# Altium schematic sheet polulu_power.SchDoc
size A4
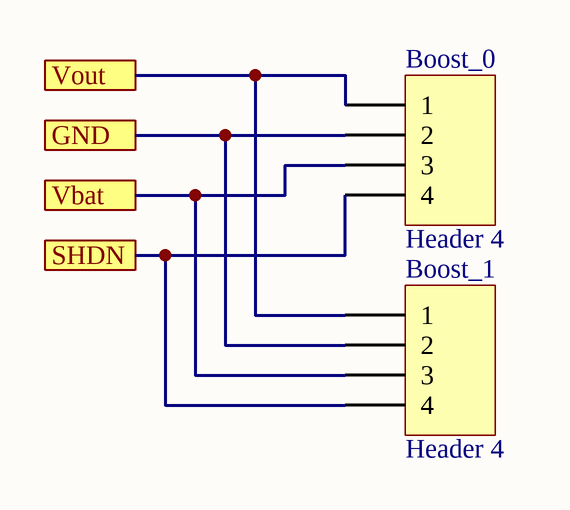
[diagram p0: polulu_power.SchDoc]

## Parts
Boost_0  Header 4  [HDR1X4]
Boost_1  Header 4  [HDR1X4]

## Ports
GND, SHDN, Vbat, Vout

## Nets
GND: Boost_0.2 Boost_1.2 ; port GND
SHDN: Boost_0.4 Boost_1.4 ; port SHDN
Vbat: Boost_0.3 Boost_1.3 ; port Vbat
Vout: Boost_0.1 Boost_1.1 ; port Vout

## Library data of the parts
Boost_0 Boost_1 = Header 4: Header, 4-Pin; LatestRevisionDate: 17-Jul-2002; LatestRevisionNote: Re-released for DXP Platform.; Publisher: Altium Limited